# Altium project IN-5200_MAIN.PrjPcb
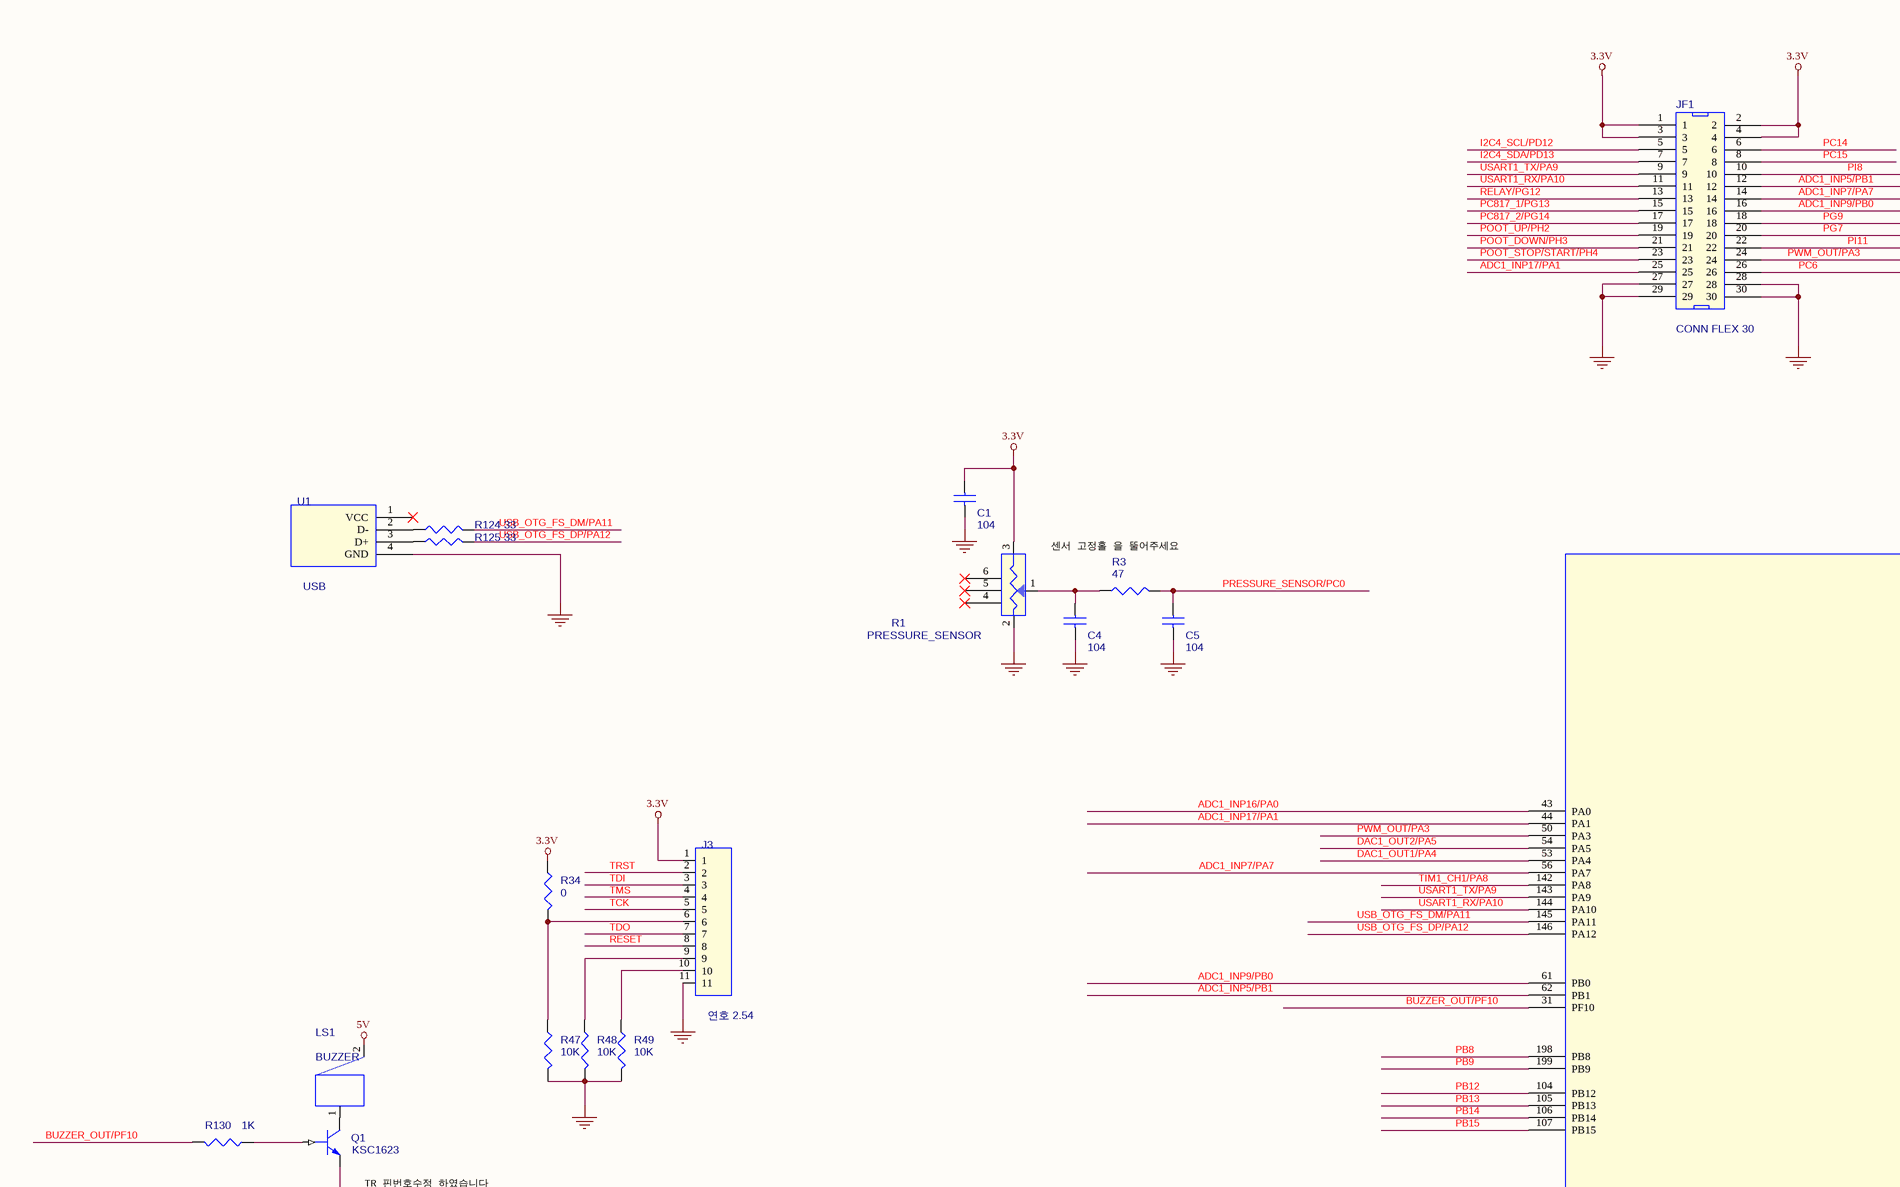
[diagram p0: PAGE1.SchDoc, top left]
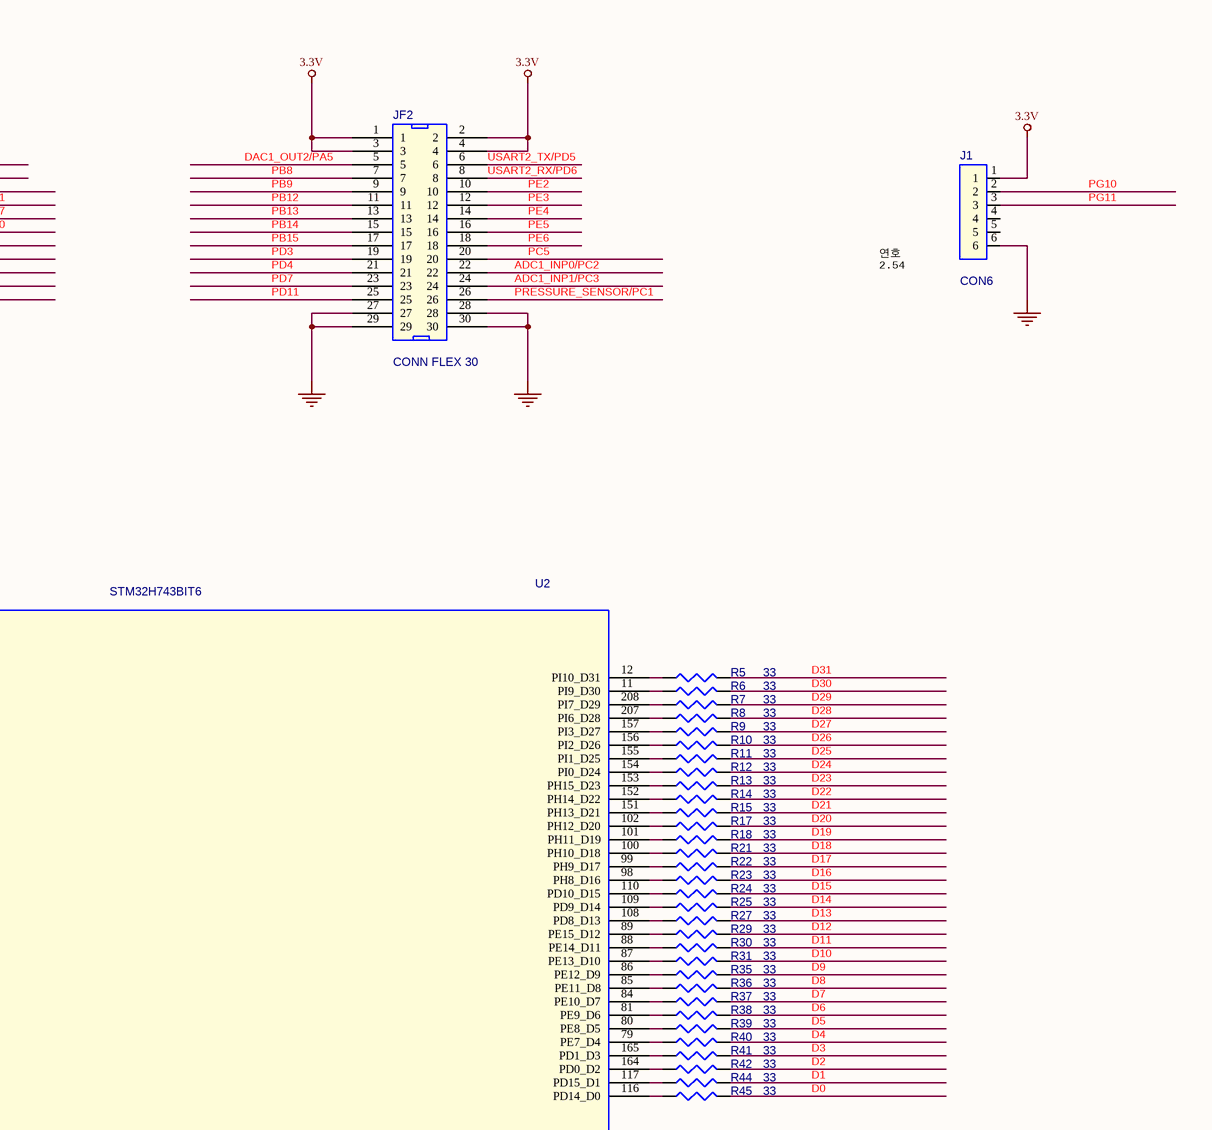
[diagram p1: PAGE1.SchDoc, top middle]
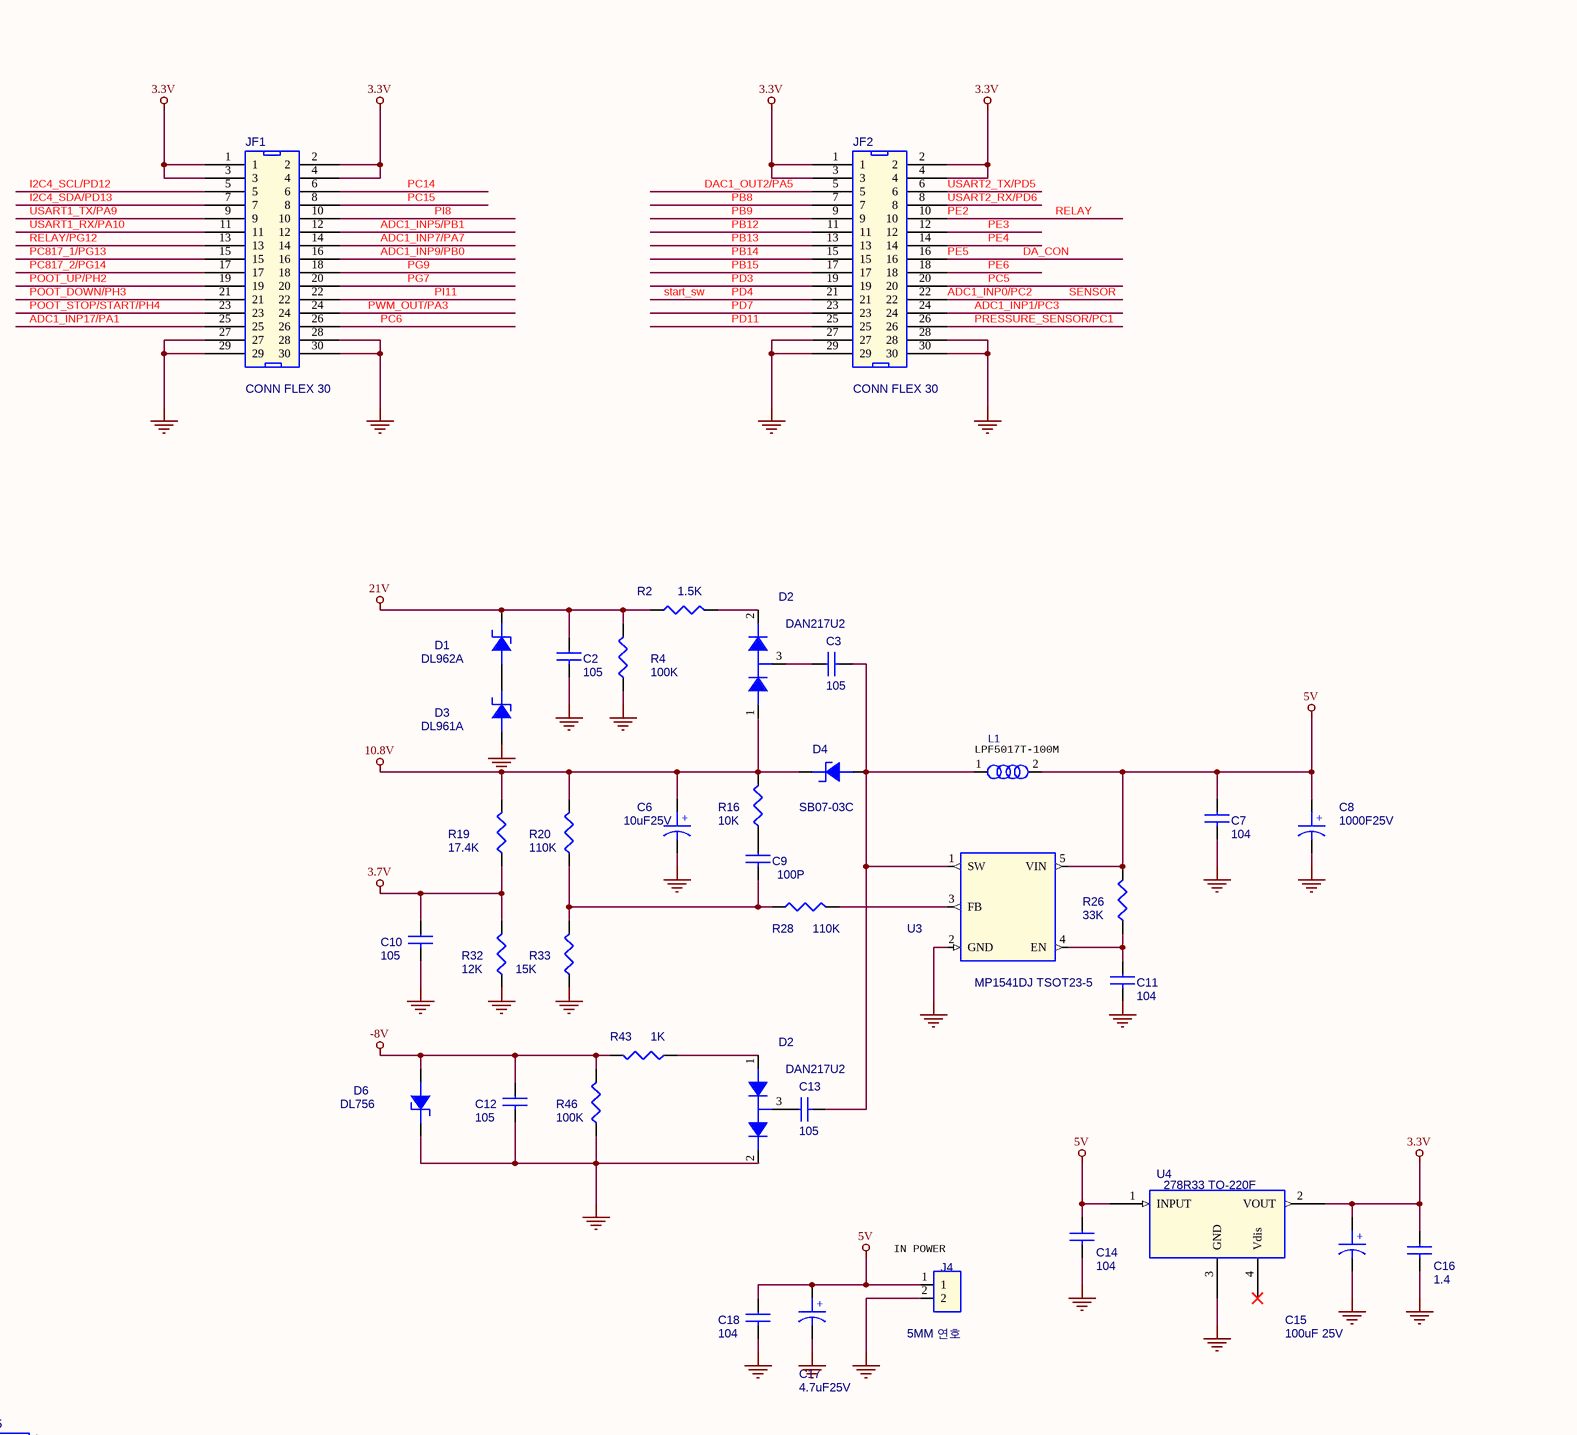
[diagram p2: PAGE1.SchDoc, top right]
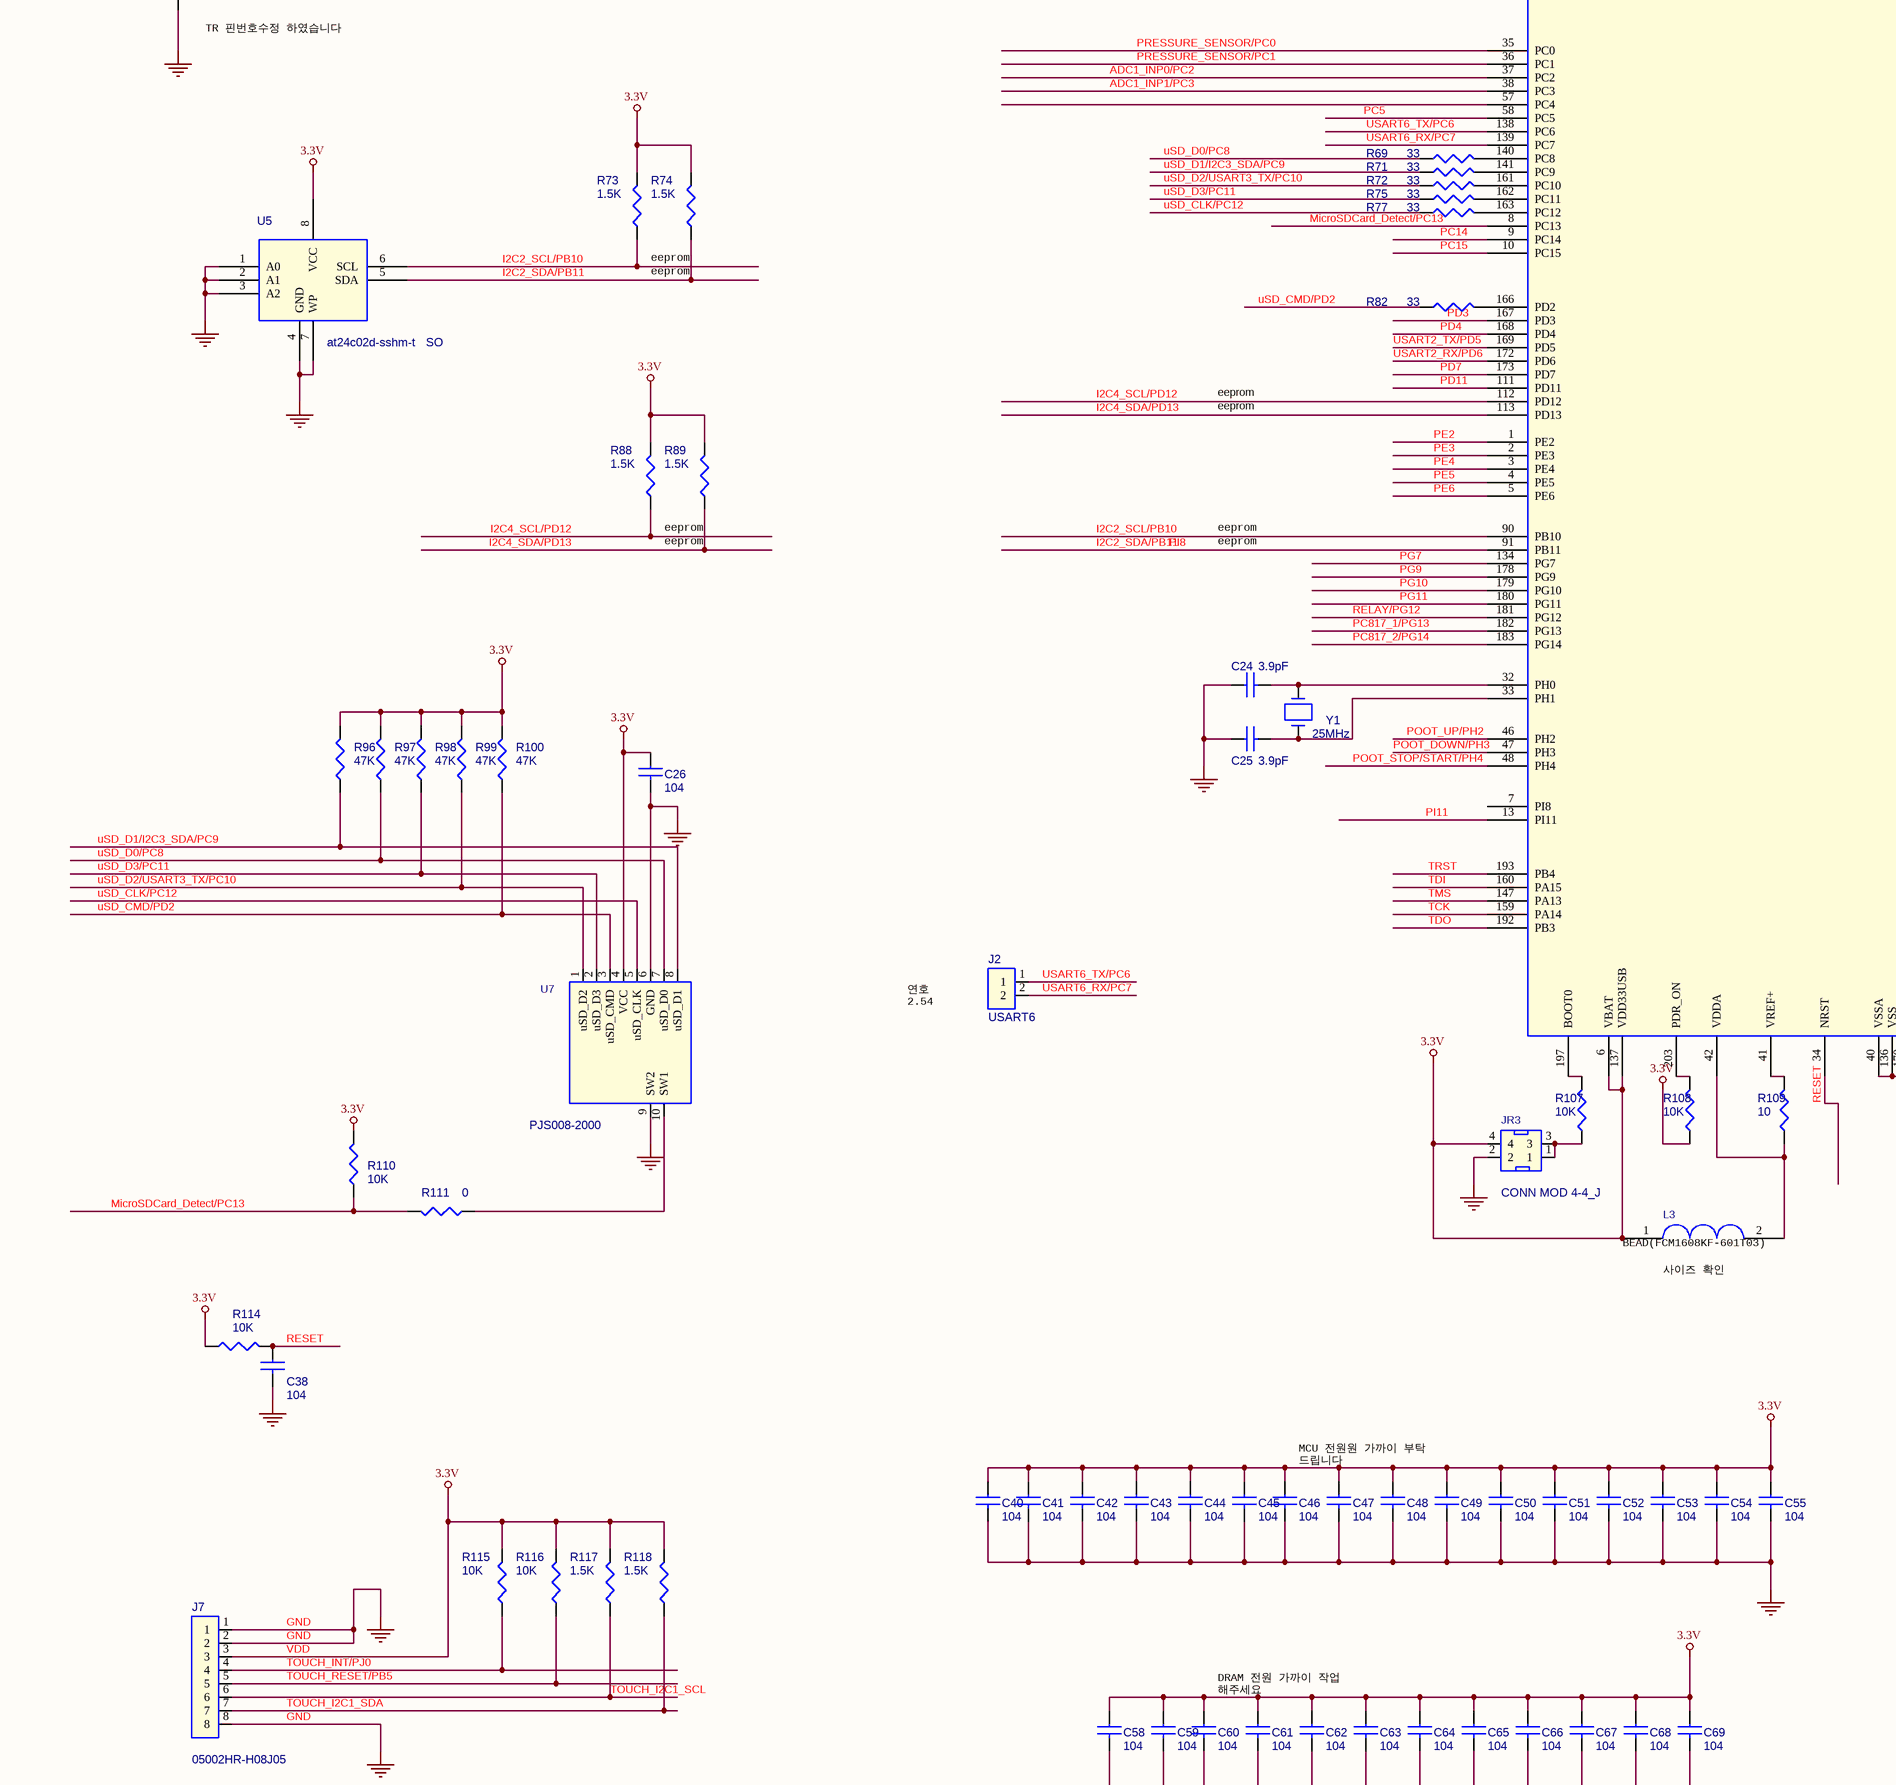
[diagram p3: PAGE1.SchDoc, centre left]
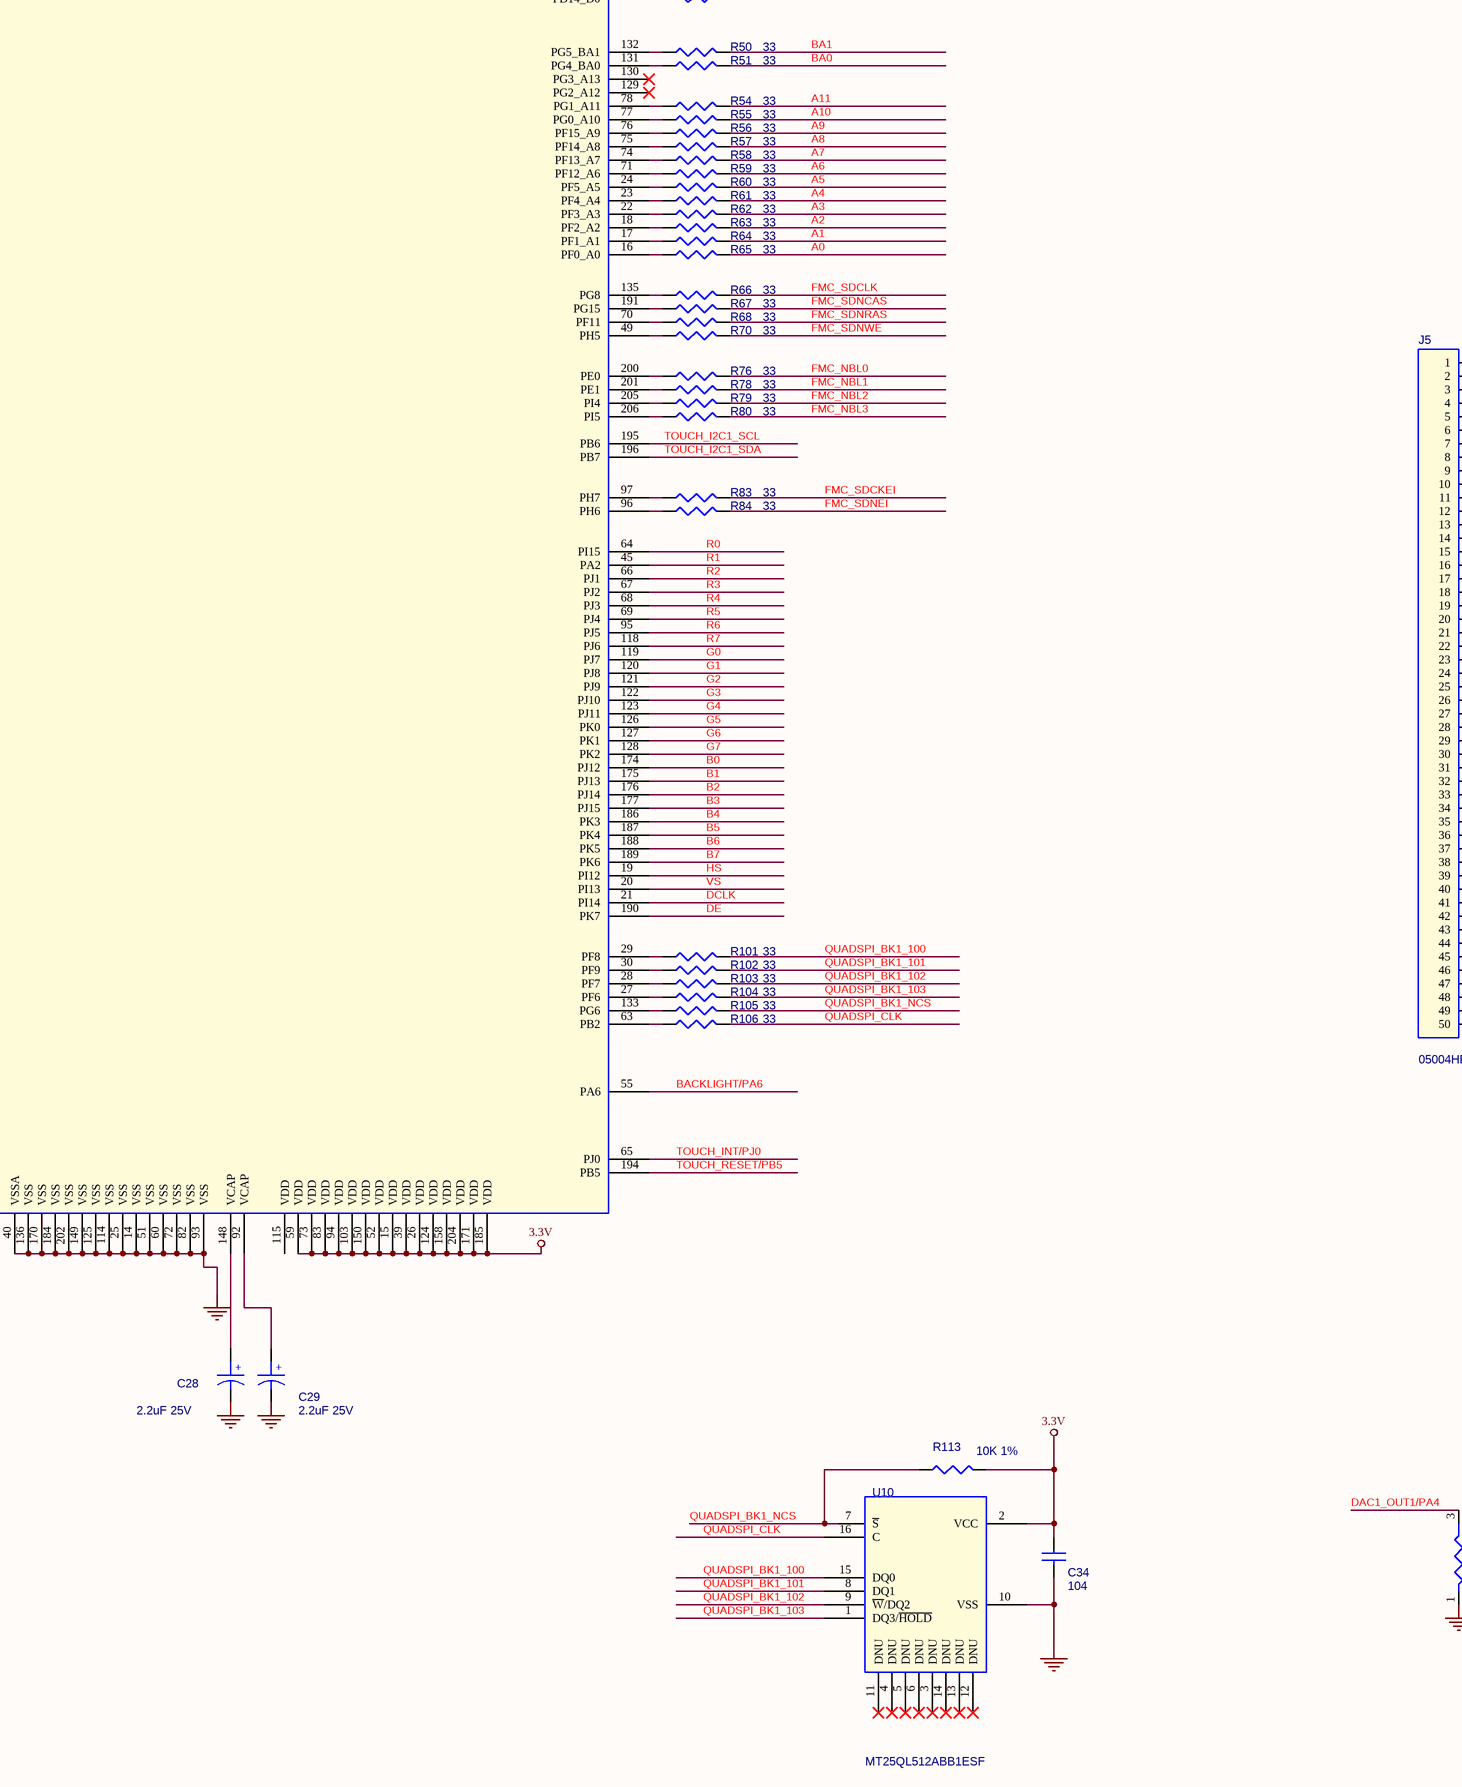
[diagram p4: PAGE1.SchDoc, centre middle]
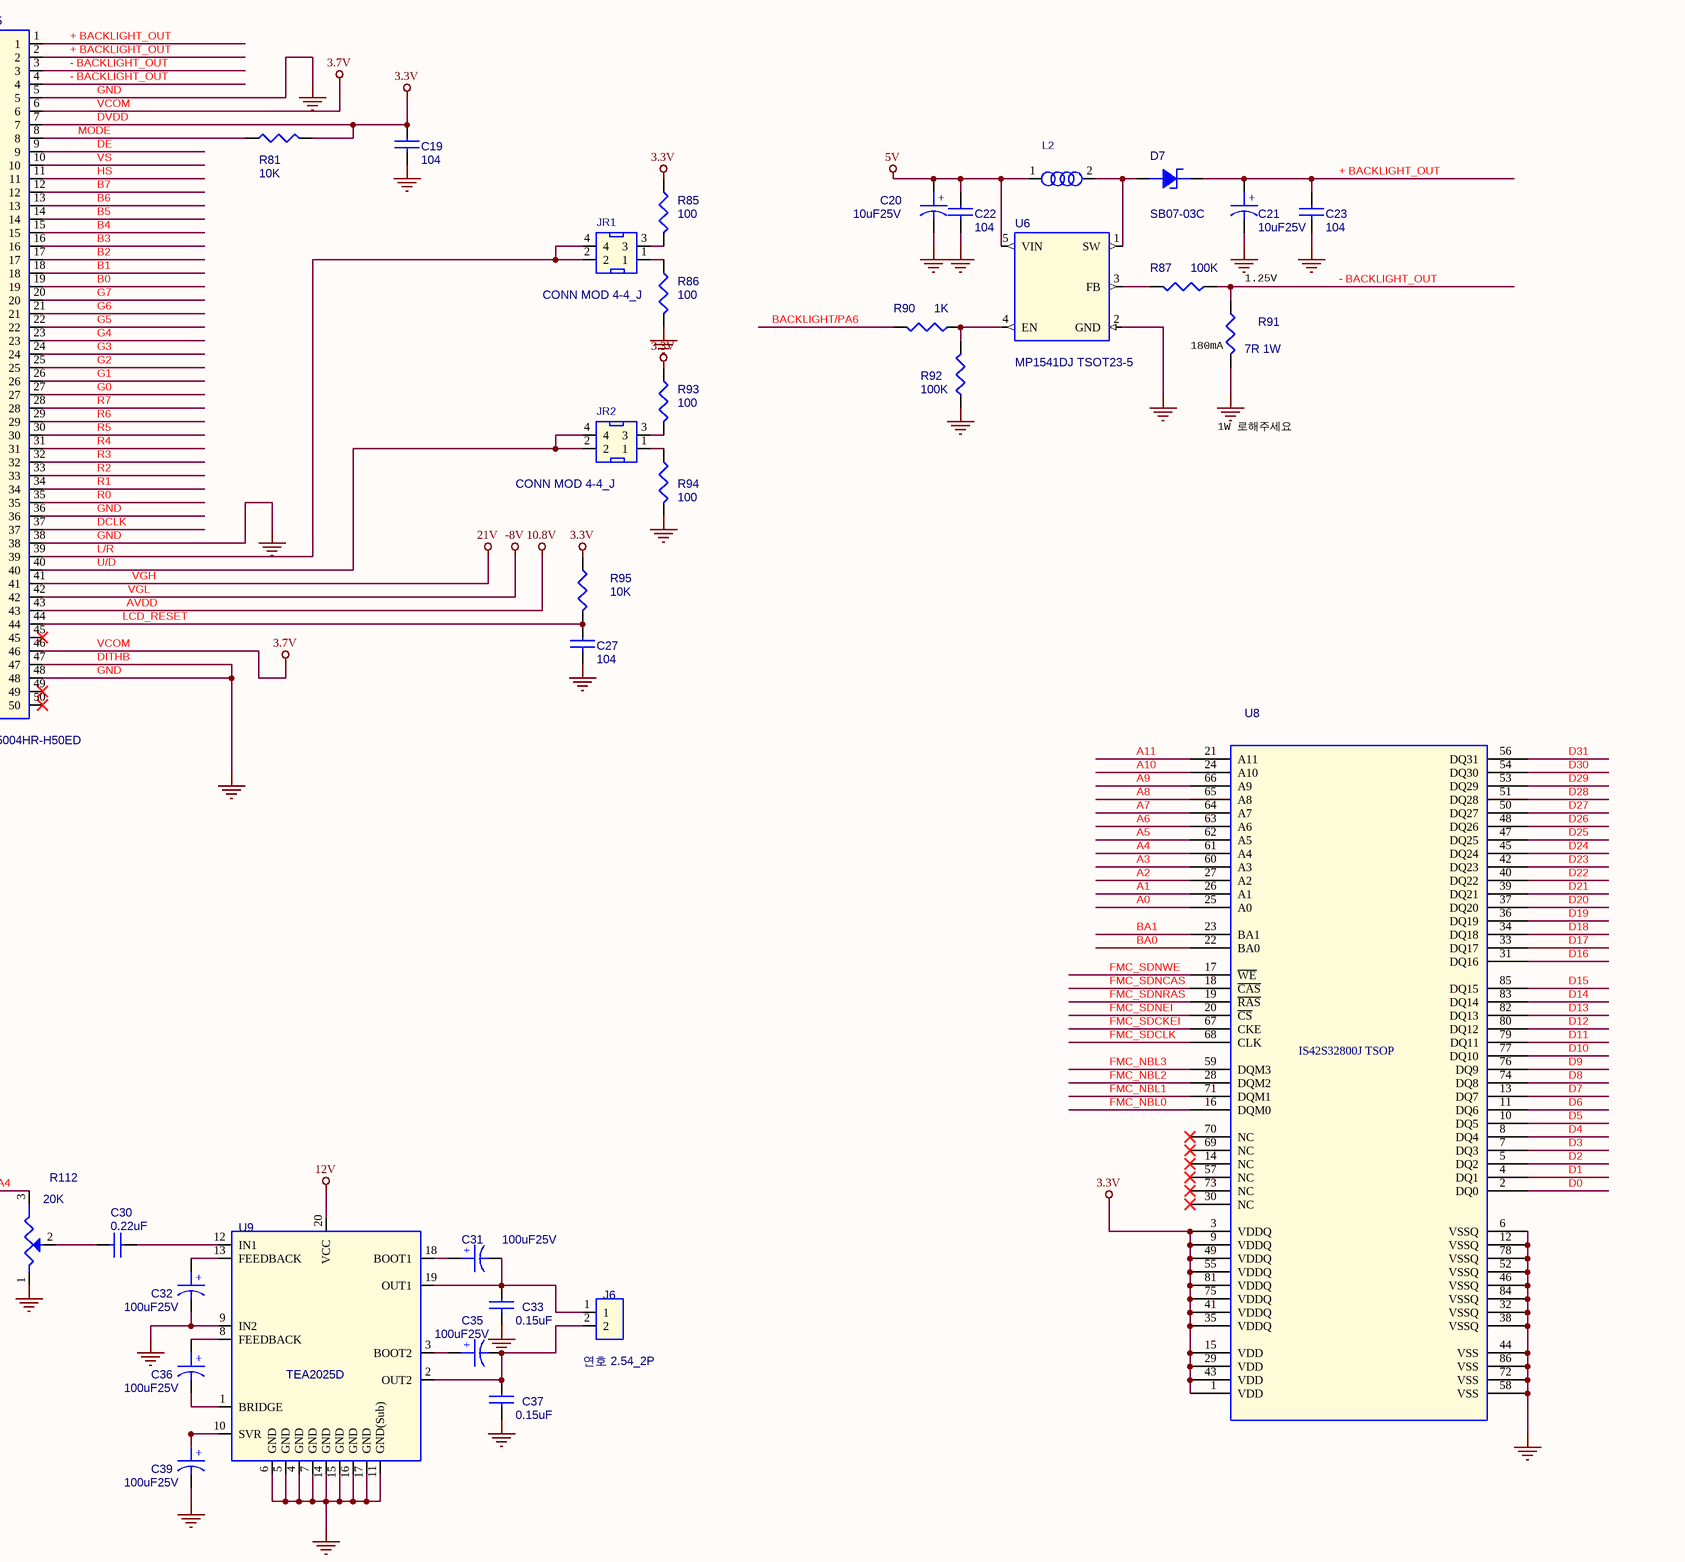
[diagram p5: PAGE1.SchDoc, centre right]
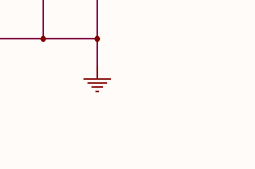
[diagram p6: PAGE1.SchDoc, bottom left]
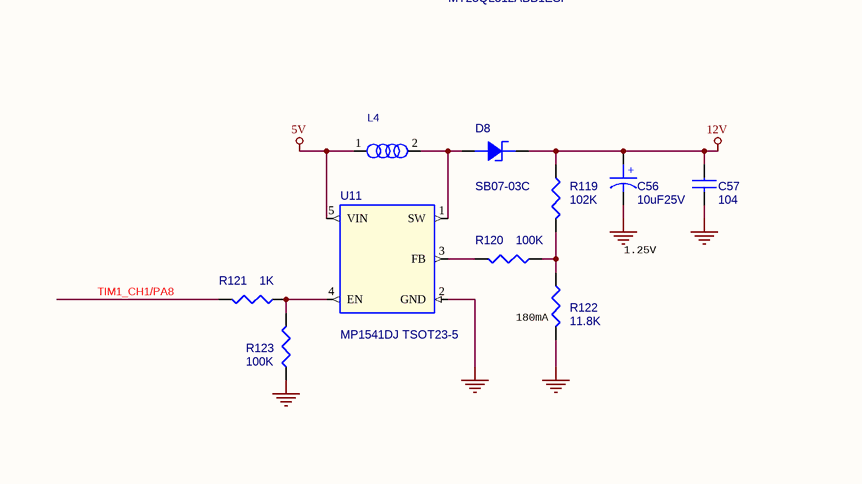
[diagram p7: PAGE1.SchDoc, bottom middle]
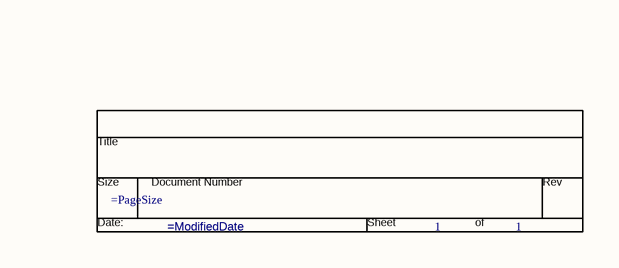
[diagram p8: PAGE1.SchDoc, bottom right]
1 sheet, 234 parts. Net scope: global (net labels, ports and power ports of the same name join across sheets).

## Sheet PAGE1.SchDoc
size 1071 x 817 mm; Page Create Date: March  8, 1995; Page Number: 1; Page Size: Custom; Comment: TitleBlock0; Page Count: 1; DsnPath: C:\Users\user\Desktop\IN-5200_MAIN.DSN; SchematicName: SCHEMATIC1; PageName: PAGE1; PageSize: Custom; TopSchematic: True

### Parts
(Parts that share a designator on the sheet are numbered #1, #2 ... from top to bottom, then left to right.)
*  Page Count: 1  (hidden comment: TitleBlock0)  (graphical)
C1  104  [C_2012]
C2  105  [C_2012]
C3  105  [C_2012]
C4  104  [C_2012]
C5  104  [C_2012]
C6  10uF25V  [ECD_5PAI]
C7  104  [C_2012]
C8  1000F25V  [ECD_10PAI]
C9  100P  [C_2012]
C10  105  [C_2012]
C11  104  [C_2012]
C12  105  [C_2012]
C13  105  [C_2012]
C14  104  [C_2012]
C15  100uF 25V  [ECD_5PAI]
C16  1.4  [C_2012]
C17  4.7uF25V  [ECD_5PAI]
C18  104  [C_2012]
C19  104  [C_2012]
C20  10uF25V  [ECD_5PAI]
C21  10uF25V  [ECD_5PAI]
C22  104  [C_2012]
C23  104  [C_2012]
C24  3.9pF  [C_2012]
C25  3.9pF  [C_2012]
C26  104  [C_2012]
C27  104  [C_2012]
C28  2.2uF 25V  [ECD_5PAI]
C29  2.2uF 25V  [ECD_5PAI]
C30  0.22uF  [C_2012]
C31  100uF25V  [ECD_5PAI]
C32  100uF25V  [ECD_5PAI]
C33  0.15uF  [C_2012]
C34  104  [C_2012]
C35  100uF25V  [ECD_5PAI]
C36  100uF25V  [ECD_5PAI]
C37  0.15uF  [C_2012]
C38  104  [C_2012]
C39  100uF25V  [ECD_5PAI]
C40  104  [C_2012]
C41  104  [C_2012]
C42  104  [C_2012]
C43  104  [C_2012]
C44  104  [C_2012]
C45  104  [C_2012]
C46  104  [C_2012]
C47  104  [C_2012]
C48  104  [C_2012]
C49  104  [C_2012]
C50  104  [C_2012]
C51  104  [C_2012]
C52  104  [C_2012]
C53  104  [C_2012]
C54  104  [C_2012]
C55  104  [C_2012]
C56  10uF25V  [ECD_5PAI]
C57  104  [C_2012]
C58  104  [C_2012]
C59  104  [C_2012]
C60  104  [C_2012]
C61  104  [C_2012]
C62  104  [C_2012]
C63  104  [C_2012]
C64  104  [C_2012]
C65  104  [C_2012]
C66  104  [C_2012]
C67  104  [C_2012]
C68  104  [C_2012]
C69  104  [C_2012]
D1  DL962A  [DIODE_DIP]
D2#1  DAN217U2  [SOT23]
D2#2  DAN217U2  [SOT23]
D3  DL961A  [DIODE_DIP]
D4  SB07-03C  [SB07-03C_SOT23]
D6  DL756  [DIODE_DIP]
D7  SB07-03C  [SB07-03C_SOT23]
D8  SB07-03C  [SB07-03C_SOT23]
J1  CON6  [SMW250-06]
J2  USART6  [SMW250-02]
J3  연호 2.54  [SMW250-11]
J4  5MM 연호  [YW500-02]
J5  05004HR-H50ED  [05004HR-H50ED-1]
J6  연호 2.54_2P  [SMW250-02]
J7  05002HR-H08J05  [05002HR-H08J05]
JF1#1  CONN FLEX 30  [CONN_2.54]
JF1#2  CONN FLEX 30  [CONN_2.54]
JF2#1  CONN FLEX 30  [CONN_2.54]
JF2#2  CONN FLEX 30  [CONN_2.54]
JR1  CONN MOD 4-4_J  [CONN_MOD44]
JR2  CONN MOD 4-4_J  [CONN_MOD44]
JR3  CONN MOD 4-4_J  [CONN_MOD44]
L1  101  [LPF5017T-100M]  (value not drawn)
L2  101  [LPF5017T-100M]  (value not drawn)
L3  TRANSFORMER AUTO  [L_2012]  (value not drawn)
L4  101  [LPF5017T-100M]  (value not drawn)
LS1  BUZZER
Q1  KSC1623
R1  PRESSURE_SENSOR  [PRESSURE_SENSOR]
R2  1.5K  [R_2012]
R3  47  [R_2012]
R4  100K  [R_2012]
R5  33  [R_2012]
R6  33  [R_2012]
R7  33  [R_2012]
R8  33  [R_2012]
R9  33  [R_2012]
R10  33  [R_2012]
R11  33  [R_2012]
R12  33  [R_2012]
R13  33  [R_2012]
R14  33  [R_2012]
R15  33  [R_2012]
R16  10K  [R_2012]
R17  33  [R_2012]
R18  33  [R_2012]
R19  17.4K  [R_2012]
R20  110K  [R_2012]
R21  33  [R_2012]
R22  33  [R_2012]
R23  33  [R_2012]
R24  33  [R_2012]
R25  33  [R_2012]
R26  33K  [R_2012]
R27  33  [R_2012]
R28  110K  [R_2012]
R29  33  [R_2012]
R30  33  [R_2012]
R31  33  [R_2012]
R32  12K  [R_2012]
R33  15K  [R_2012]
R34  0  [R_2012]
R35  33  [R_2012]
R36  33  [R_2012]
R37  33  [R_2012]
R38  33  [R_2012]
R39  33  [R_2012]
R40  33  [R_2012]
R41  33  [R_2012]
R42  33  [R_2012]
R43  1K  [R_2012]
R44  33  [R_2012]
R45  33  [R_2012]
R46  100K  [R_2012]
R47  10K  [R_2012]
R48  10K  [R_2012]
R49  10K  [R_2012]
R50  33  [R_2012]
R51  33  [R_2012]
R54  33  [R_2012]
R55  33  [R_2012]
R56  33  [R_2012]
R57  33  [R_2012]
R58  33  [R_2012]
R59  33  [R_2012]
R60  33  [R_2012]
R61  33  [R_2012]
R62  33  [R_2012]
R63  33  [R_2012]
R64  33  [R_2012]
R65  33  [R_2012]
R66  33  [R_2012]
R67  33  [R_2012]
R68  33  [R_2012]
R69  33  [R_2012]
R70  33  [R_2012]
R71  33  [R_2012]
R72  33  [R_2012]
R73  1.5K  [R_2012]
R74  1.5K  [R_2012]
R75  33  [R_2012]
R76  33  [R_2012]
R77  33  [R_2012]
R78  33  [R_2012]
R79  33  [R_2012]
R80  33  [R_2012]
R81  10K  [R_2012]
R82  33  [R_2012]
R83  33  [R_2012]
R84  33  [R_2012]
R85  100  [R_2012]
R86  100  [R_2012]
R87  100K  [R_2012]
R88  1.5K  [R_2012]
R89  1.5K  [R_2012]
R90  1K  [R_2012]
R91  7R 1W  [R_2012]
R92  100K  [R_2012]
R93  100  [R_2012]
R94  100  [R_2012]
R95  10K  [R_2012]
R96  47K  [R_2012]
R97  47K  [R_2012]
R98  47K  [R_2012]
R99  47K  [R_2012]
R100  47K  [R_2012]
R101  33  [R_2012]
R102  33  [R_2012]
R103  33  [R_2012]
R104  33  [R_2012]
R105  33  [R_2012]
R106  33  [R_2012]
R107  10K  [R_2012]
R108  10K  [R_2012]
R109  10  [R_2012]
R110  10K  [R_2012]
R111  0  [R_2012]
R112  20K  [R_2012]
R113  10K 1%  [R_2012]
R114  10K  [VRES\WIW1036(3323)P]
R115  10K  [R_2012]
R116  10K  [R_2012]
R117  1.5K  [R_2012]
R118  1.5K  [R_2012]
R119  102K  [R_2012]
R120  100K  [R_2012]
R121  1K  [R_2012]
R122  11.8K  [R_2012]
R123  100K  [R_2012]
R124  33  [R_2012]
R125  33  [R_2012]
R130  1K
U1  USB  [CON4_12505WR\]
U2  STM32H743BIT6  [STM32H743BIT6_0.5_208]
U3  MP1541DJ TSOT23-5  [SOT23-5]
U4  278R33 TO-220F
U5  at24c02d-sshm-t   SO  [SO8_P1.27_L6]
U6  MP1541DJ TSOT23-5  [SOT23-5]
U7  PJS008-2000  [7MSDP-1]
U8  IS42S32800J TSOP  [IS42S32800J_0.5_86]
U9  TEA2025D  [SO20_P1.27_L10.3]
U10  MT25QL512ABB1ESF  [MT25QL512ABB1ESF_SO16]
U11  MP1541DJ TSOT23-5  [SOT23-5]
Y1  25MHz  [XTAL_SMD]

### Nets
5V: C7.1 C8.1 C14.1 C17.1 C18.1 C20.1 C22.1 J4.1 L1.2(SF) L2.1(SF) L4.1(SF) LS1.2(B) R26.2 U3.5(VIN) U4.1(INPUT) U6.5(VIN) U11.5(VIN)
12V: C56.1 C57.1 D8.2(CATHODE) R119.1 U9.20(VCC)
AVDD: C6.1 D2#1.1(CATHODE) D4.2(CATHODE) J5.43 R16.2 R19.2 R20.2  [also labelled 10.8V]
DITHB: C2.2 C7.2 C10.2 C11.2 C12.2 C18.2 C24.1 C25.1 C34.2 D2#2.2(ANODE) D3.1(ANODE) D6.2(CATHODE) J1.6 J4.2 J5.5 J5.36 J5.38 J5.47 J5.48 J7.1 J7.2 J7.8 JF1#1.27 JF1#1.28 JF1#1.29 JF1#1.30 JF1#2.27 JF1#2.28 JF1#2.29 JF1#2.30 JF2#1.27 JF2#1.28 JF2#1.29 JF2#1.30 JF2#2.27 JF2#2.28 JF2#2.29 JF2#2.30 R1.2(WIPER) R4.1 R32.1 R33.1 R46.1 R86.2 R91.2 R92.1 R94.2 R112.1(A) R122.2 R123.1 U1.4(GND) U2.14(VSS) U2.25(VSS) U2.40(VSSA) U2.51(VSS) U2.60(VSS) U2.72(VSS) U2.82(VSS) U2.93(VSS) U2.114(VSS) U2.125(VSS) U2.136(VSS) U2.149(VSS) U2.170(VSS) U2.184(VSS) U2.202(VSS) U3.2(GND) U8.6(VSSQ) U8.12(VSSQ) U8.32(VSSQ) U8.38(VSSQ) U8.44(VSS) U8.46(VSSQ) U8.52(VSSQ) U8.58(VSS) U8.72(VSS) U8.78(VSSQ) U8.84(VSSQ) U8.86(VSS) U10.10(VSS) U11.2(GND)  [also labelled GND]
DVDD: C1.1 C15.1 C16.1 C19.1 C26.1 C34.1 C40.1 C41.1 C42.1 C43.1 C44.1 C45.1 C46.1 C47.1 C48.1 C49.1 C50.1 C51.1 C52.1 C53.1 C54.1 C55.1 C58.1 C59.1 C60.1 C61.1 C62.1 C63.1 C64.1 C65.1 C66.1 C67.1 C68.1 C69.1 J1.1 J3.1 J5.7 J7.3 JF1#1.1 JF1#1.2 JF1#1.3 JF1#1.4 JF1#2.1 JF1#2.2 JF1#2.3 JF1#2.4 JF2#1.1 JF2#1.2 JF2#1.3 JF2#1.4 JF2#2.1 JF2#2.2 JF2#2.3 JF2#2.4 JR3.4 L3.1(SF) R1.3(B) R34.1 R73.2 R74.2 R81.2 R85.1 R88.2 R89.2 R93.1 R95.1 R96.2 R97.2 R98.2 R99.2 R100.2 R108.1 R110.2 R113.2 R114.1 R115.2 R116.2 R117.2 R118.2 U2.6(VBAT) U2.15(VDD) U2.26(VDD) U2.39(VDD) U2.52(VDD) U2.59(VDD) U2.73(VDD) U2.83(VDD) U2.94(VDD) U2.103(VDD) U2.124(VDD) U2.137(VDD33USB) U2.150(VDD) U2.158(VDD) U2.171(VDD) U2.185(VDD) U2.204(VDD) U4.2(VOUT) U5.8(VCC) U7.4(VCC) U8.1(VDD) U8.3(VDDQ) U8.9(VDDQ) U8.15(VDD) U8.29(VDD) U8.35(VDDQ) U8.41(VDDQ) U8.43(VDD) U8.49(VDDQ) U8.55(VDDQ) U8.75(VDDQ) U8.81(VDDQ) U10.2(VCC)  [also labelled 3.3V, VDD]
GND POWER: J3.11 Q1.2(EMITTER) R47.2 R48.2 R49.2 U5.1(A0) U5.2(A1) U5.3(A2) U5.4(GND) U5.7(WP)
GND_POWER: C1.2 C4.2 C5.2 C6.2 C8.2 C14.2 C15.2 C16.2 C17.2 C19.2 C20.2 C21.2 C22.2 C23.2 C26.2 C27.2 C28.2 C29.2 C32.2 C33.2 C37.2 C38.2 C39.2 C40.2 C41.2 C42.2 C43.2 C44.2 C45.2 C46.2 C47.2 C48.2 C49.2 C50.2 C51.2 C52.2 C53.2 C54.2 C55.2 C56.2 C57.2 C58.2 C59.2 C60.2 C61.2 C62.2 C63.2 C64.2 C65.2 C66.2 C67.2 C68.2 C69.2 JR3.2 U4.3(GND) U6.2(GND) U7.6(GND) U7.9(SW2) U9.4(GND) U9.5(GND) U9.6(GND) U9.7(GND) U9.9(IN2) U9.11(GND(Sub)) U9.14(GND) U9.15(GND) U9.16(GND) U9.17(GND)
VCOM: C10.1 J5.6 J5.46 R19.1 R32.2  [also labelled 3.7V]
VGH: C2.1 D1.2(CATHODE) J5.41 R2.1 R4.2  [also labelled 21V]
VGL: C12.1 D6.1(ANODE) J5.42 R43.2 R46.2  [also labelled -8V]
+ BACKLIGHT_OUT: C21.1 C23.1 D7.2(CATHODE) J5.1 J5.2
- BACKLIGHT_OUT: J5.3 J5.4 R87.1 R91.1
A0: R65.2 U8.25(A0)
A1: R64.2 U8.26(A1)
A2: R63.2 U8.27(A2)
A3: R62.2 U8.60(A3)
A4: R61.2 U8.61(A4)
A5: R60.2 U8.62(A5)
A6: R59.2 U8.63(A6)
A7: R58.2 U8.64(A7)
A8: R57.2 U8.65(A8)
A9: R56.2 U8.66(A9)
A10: R55.2 U8.24(A10)
A11: R54.2 U8.21(A11)
ADC1_INP0/PC2: JF2#1.22 JF2#2.22 U2.37(PC2)  [also labelled SENSOR]
ADC1_INP1/PC3: JF2#1.24 JF2#2.24 U2.38(PC3)
ADC1_INP5/PB1: JF1#1.12 JF1#2.12 U2.62(PB1)
ADC1_INP7/PA7: JF1#1.14 JF1#2.14 U2.56(PA7)
ADC1_INP9/PB0: JF1#1.16 JF1#2.16 U2.61(PB0)
ADC1_INP16/PA0: U2.43(PA0)
ADC1_INP17/PA1: JF1#1.25 JF1#2.25 U2.44(PA1)
B0: J5.19 U2.174(PJ12)
B1: J5.18 U2.175(PJ13)
B2: J5.17 U2.176(PJ14)
B3: J5.16 U2.177(PJ15)
B4: J5.15 U2.186(PK3)
B5: J5.14 U2.187(PK4)
B6: J5.13 U2.188(PK5)
B7: J5.12 U2.189(PK6)
BA0: R51.2 U8.22(BA0)
BA1: R50.2 U8.23(BA1)
BACKLIGHT/PA6: R90.2 U2.55(PA6)
BUZZER_OUT/PF10: R130.2 U2.31(PF10)
D0: R45.2 U8.2(DQ0)
D1: R44.2 U8.4(DQ1)
D2: R42.2 U8.5(DQ2)
D3: R41.2 U8.7(DQ3)
D4: R40.2 U8.8(DQ4)
D5: R39.2 U8.10(DQ5)
D6: R38.2 U8.11(DQ6)
D7: R37.2 U8.13(DQ7)
D8: R36.2 U8.74(DQ8)
D9: R35.2 U8.76(DQ9)
D10: R31.2 U8.77(DQ10)
D11: R30.2 U8.79(DQ11)
D12: R29.2 U8.80(DQ12)
D13: R27.2 U8.82(DQ13)
D14: R25.2 U8.83(DQ14)
D15: R24.2 U8.85(DQ15)
D16: R23.2 U8.31(DQ16)
D17: R22.2 U8.33(DQ17)
D18: R21.2 U8.34(DQ18)
D19: R18.2 U8.36(DQ19)
D20: R17.2 U8.37(DQ20)
D21: R15.2 U8.39(DQ21)
D22: R14.2 U8.40(DQ22)
D23: R13.2 U8.42(DQ23)
D24: R12.2 U8.45(DQ24)
D25: R11.2 U8.47(DQ25)
D26: R10.2 U8.48(DQ26)
D27: R9.2 U8.50(DQ27)
D28: R8.2 U8.51(DQ28)
D29: R7.2 U8.53(DQ29)
D30: R6.2 U8.54(DQ30)
D31: R5.2 U8.56(DQ31)
DA_CON: JF2#1.16 JF2#2.16 U2.4(PE5)  [also labelled PE5]
DAC1_OUT1/PA4: R112.3(B) U2.53(PA4)
DAC1_OUT2/PA5: JF2#1.5 JF2#2.5 U2.54(PA5)
DCLK: J5.37 U2.21(PI14)
DE: J5.9 U2.190(PK7)
FMC_NBL0: R76.2 U8.16(DQM0)
FMC_NBL1: R78.2 U8.71(DQM1)
FMC_NBL2: R79.2 U8.28(DQM2)
FMC_NBL3: R80.2 U8.59(DQM3)
FMC_SDCKEI: R83.2 U8.67(CKE)
FMC_SDCLK: R66.2 U8.68(CLK)
FMC_SDNCAS: R67.2 U8.18(~{CAS})
FMC_SDNEI: R84.2 U8.20(~{CS})
FMC_SDNRAS: R68.2 U8.19(~{RAS})
FMC_SDNWE: R70.2 U8.17(~{WE})
G0: J5.27 U2.119(PJ7)
G1: J5.26 U2.120(PJ8)
G2: J5.25 U2.121(PJ9)
G3: J5.24 U2.122(PJ10)
G4: J5.23 U2.123(PJ11)
G5: J5.22 U2.126(PK0)
G6: J5.21 U2.127(PK1)
G7: J5.20 U2.128(PK2)
HS: J5.11 U2.19(PI12)
I2C2_SCL/PB10: R73.1 U2.90(PB10) U5.6(SCL)
I2C2_SDA/PB11: JF1#1.10 JF1#2.10 R74.1 U2.91(PB11) U5.5(SDA)  [also labelled PI8]
I2C4_SCL/PD12: JF1#1.5 JF1#2.5 R88.1 U2.112(PD12)
I2C4_SDA/PD13: JF1#1.7 JF1#2.7 R89.1 U2.113(PD13)
L/R: J5.39 JR1.2 JR1.4
LCD_RESET: C27.1 J5.44 R95.2
MicroSDCard_Detect/PC13: R110.1 R111.2 U2.8(PC13)
MODE: J5.8 R81.1
PB8: JF2#1.7 JF2#2.7 U2.198(PB8)
PB9: JF2#1.9 JF2#2.9 U2.199(PB9)
PB12: JF2#1.11 JF2#2.11 U2.104(PB12)
PB13: JF2#1.13 JF2#2.13 U2.105(PB13)
PB14: JF2#1.15 JF2#2.15 U2.106(PB14)
PB15: JF2#1.17 JF2#2.17 U2.107(PB15)
PC5: JF2#1.20 JF2#2.20 U2.58(PC5)
PC6: JF1#1.26 JF1#2.26
PC14: JF1#1.6 JF1#2.6 U2.9(PC14)
PC15: JF1#1.8 JF1#2.8 U2.10(PC15)
PC817_1/PG13: JF1#1.15 JF1#2.15 U2.182(PG13)
PC817_2/PG14: JF1#1.17 JF1#2.17 U2.183(PG14)
PD3: JF2#1.19 JF2#2.19 U2.167(PD3)
PD4: JF2#1.21 JF2#2.21 U2.168(PD4)  [also labelled start_sw]
PD7: JF2#1.23 JF2#2.23 U2.173(PD7)
PD11: JF2#1.25 JF2#2.25 U2.111(PD11)
PE2: JF2#1.10 JF2#2.10 U2.1(PE2)  [also labelled RELAY]
PE3: JF2#1.12 JF2#2.12 U2.2(PE3)
PE4: JF2#1.14 JF2#2.14 U2.3(PE4)
PE6: JF2#1.18 JF2#2.18 U2.5(PE6)
PG7: JF1#1.20 JF1#2.20 U2.134(PG7)
PG9: JF1#1.18 JF1#2.18 U2.178(PG9)
PG10: J1.2 U2.179(PG10)
PG11: J1.3 U2.180(PG11)
PI11: JF1#1.22 JF1#2.22 U2.13(PI11)
POOT_DOWN/PH3: JF1#1.21 JF1#2.21 U2.47(PH3)
POOT_STOP/START/PH4: JF1#1.23 JF1#2.23 U2.48(PH4)
POOT_UP/PH2: JF1#1.19 JF1#2.19 U2.46(PH2)
PRESSURE_SENSOR/PC0: C5.1 R3.2 U2.35(PC0)
PRESSURE_SENSOR/PC1: JF2#1.26 JF2#2.26 U2.36(PC1)
PWM_OUT/PA3: JF1#1.24 JF1#2.24 U2.50(PA3)
QUADSPI_BK1_100: R101.2 U10.15(DQ0)
QUADSPI_BK1_101: R102.2 U10.8(DQ1)
QUADSPI_BK1_102: R103.2 U10.9(~{W}/DQ2)
QUADSPI_BK1_103: R104.2 U10.1(DQ3/~{HOLD})
QUADSPI_BK1_NCS: R105.2 R113.1 U10.7(~{S})
QUADSPI_CLK: R106.2 U10.16(C)
R0: J5.35 U2.64(PI15)
R1: J5.34 U2.45(PA2)
R2: J5.33 U2.66(PJ1)
R3: J5.32 U2.67(PJ2)
R4: J5.31 U2.68(PJ3)
R5: J5.30 U2.69(PJ4)
R6: J5.29 U2.95(PJ5)
R7: J5.28 U2.118(PJ6)
RELAY/PG12: JF1#1.13 JF1#2.13 U2.181(PG12)
RESET: C38.1 J3.8 R114.2 U2.34(NRST)
TCK: J3.5 U2.159(PA14)
TDI: J3.3 U2.160(PA15)
TDO: J3.7 U2.192(PB3)
TIM1_CH1/PA8: R121.2 U2.142(PA8)
TMS: J3.4 U2.147(PA13)
TOUCH_I2C1_SCL: J7.6 R117.1 U2.195(PB6)
TOUCH_I2C1_SDA: J7.7 R118.1 U2.196(PB7)
TOUCH_INT/PJ0: J7.4 R115.1 U2.65(PJ0)
TOUCH_RESET/PB5: J7.5 R116.1 U2.194(PB5)
TRST: J3.2 U2.193(PB4)
U/D: J5.40 JR2.2 JR2.4
USART1_RX/PA10: JF1#1.11 JF1#2.11 U2.144(PA10)
USART1_TX/PA9: JF1#1.9 JF1#2.9 U2.143(PA9)
USART2_RX/PD6: JF2#1.8 JF2#2.8 U2.172(PD6)
USART2_TX/PD5: JF2#1.6 JF2#2.6 U2.169(PD5)
USART6_RX/PC7: J2.2 U2.139(PC7)
USART6_TX/PC6: J2.1 U2.138(PC6)
USB_OTG_FS_DM/PA11: R124.2 U2.145(PA11)
USB_OTG_FS_DP/PA12: R125.2 U2.146(PA12)
uSD_CLK/PC12: R77.1 U7.5(uSD_CLK)
uSD_CMD/PD2: R82.1 R100.1 U7.3(uSD_CMD)
uSD_D0/PC8: R69.1 R97.1 U7.7(uSD_D0)
uSD_D1/I2C3_SDA/PC9: R71.1 R96.1 U7.8(uSD_D1)
uSD_D2/USART3_TX/PC10: R72.1 R99.1 U7.1(uSD_D2)
uSD_D3/PC11: R75.1 R98.1 U7.2(uSD_D3)
VS: J5.10 U2.20(PI13)
NetC3_1: C3.1 D2#1.3(COM)
NetC3_2: C3.2 C13.2 D4.1(ANODE) L1.1(SF) U3.1(SW)
NetC4_1: C4.1 R1.1(A) R3.1
NetC9_1: C9.1 R16.1
NetC9_2: C9.2 R20.1 R28.1 R33.2
NetC11_1: C11.1 R26.1 U3.4(EN)
NetC13_1: C13.1 D2#2.3(COM)
NetC24_2: C24.2 U2.32(PH0) Y1.2
NetC25_2: C25.2 U2.33(PH1) Y1.1
NetC28_1: C28.1 U2.148(VCAP)
NetC29_1: C29.1 U2.92(VCAP)
NetC30_1: C30.1 U9.12(IN1)
NetC30_2: C30.2 R112.2(WIPER)
NetC31_1: C31.1 U9.18(BOOT1)
NetC31_2: C31.2 C33.1 J6.1 U9.19(OUT1)
NetC32_1: C32.1 U9.13(FEEDBACK)
NetC35_1: C35.1 U9.3(BOOT2)
NetC35_2: C35.2 C37.1 J6.2 U9.2(OUT2)
NetC36_1: C36.1 U9.8(FEEDBACK)
NetC36_2: C36.2 U9.1(BRIDGE)
NetC39_1: C39.1 U9.10(SVR)
NetD1_1: D1.1(ANODE) D3.2(CATHODE)
NetD2#1_2: D2#1.2(ANODE) R2.2
NetD2#2_1: D2#2.1(CATHODE) R43.1
NetD7_1: D7.1(ANODE) L2.2(SF) U6.1(SW)
NetD8_1: D8.1(ANODE) L4.2(SF) U11.1(SW)
NetJ3_6: J3.6 R34.2 R47.1
NetJ3_9: J3.9 R48.1
NetJ3_10: J3.10 R49.1
NetJR1_1: JR1.1 R86.1
NetJR1_3: JR1.3 R85.2
NetJR2_1: JR2.1 R94.1
NetJR2_3: JR2.3 R93.2
NetJR3_1: JR3.1 JR3.3 R107.1
NetL3_2: L3.2(SF) R109.1 U2.42(VDDA)
NetLS1_1: LS1.1(A) Q1.3(COLLECTOR)
NetQ1_1: Q1.1(BASE) R130.1
NetR5_1: R5.1 U2.12(PI10_D31)
NetR6_1: R6.1 U2.11(PI9_D30)
NetR7_1: R7.1 U2.208(PI7_D29)
NetR8_1: R8.1 U2.207(PI6_D28)
NetR9_1: R9.1 U2.157(PI3_D27)
NetR10_1: R10.1 U2.156(PI2_D26)
NetR11_1: R11.1 U2.155(PI1_D25)
NetR12_1: R12.1 U2.154(PI0_D24)
NetR13_1: R13.1 U2.153(PH15_D23)
NetR14_1: R14.1 U2.152(PH14_D22)
NetR15_1: R15.1 U2.151(PH13_D21)
NetR17_1: R17.1 U2.102(PH12_D20)
NetR18_1: R18.1 U2.101(PH11_D19)
NetR21_1: R21.1 U2.100(PH10_D18)
NetR22_1: R22.1 U2.99(PH9_D17)
NetR23_1: R23.1 U2.98(PH8_D16)
NetR24_1: R24.1 U2.110(PD10_D15)
NetR25_1: R25.1 U2.109(PD9_D14)
NetR27_1: R27.1 U2.108(PD8_D13)
NetR28_2: R28.2 U3.3(FB)
NetR29_1: R29.1 U2.89(PE15_D12)
NetR30_1: R30.1 U2.88(PE14_D11)
NetR31_1: R31.1 U2.87(PE13_D10)
NetR35_1: R35.1 U2.86(PE12_D9)
NetR36_1: R36.1 U2.85(PE11_D8)
NetR37_1: R37.1 U2.84(PE10_D7)
NetR38_1: R38.1 U2.81(PE9_D6)
NetR39_1: R39.1 U2.80(PE8_D5)
NetR40_1: R40.1 U2.79(PE7_D4)
NetR41_1: R41.1 U2.165(PD1_D3)
NetR42_1: R42.1 U2.164(PD0_D2)
NetR44_1: R44.1 U2.117(PD15_D1)
NetR45_1: R45.1 U2.116(PD14_D0)
NetR50_1: R50.1 U2.132(PG5_BA1)
NetR51_1: R51.1 U2.131(PG4_BA0)
NetR54_1: R54.1 U2.78(PG1_A11)
NetR55_1: R55.1 U2.77(PG0_A10)
NetR56_1: R56.1 U2.76(PF15_A9)
NetR57_1: R57.1 U2.75(PF14_A8)
NetR58_1: R58.1 U2.74(PF13_A7)
NetR59_1: R59.1 U2.71(PF12_A6)
NetR60_1: R60.1 U2.24(PF5_A5)
NetR61_1: R61.1 U2.23(PF4_A4)
NetR62_1: R62.1 U2.22(PF3_A3)
NetR63_1: R63.1 U2.18(PF2_A2)
NetR64_1: R64.1 U2.17(PF1_A1)
NetR65_1: R65.1 U2.16(PF0_A0)
NetR66_1: R66.1 U2.135(PG8)
NetR67_1: R67.1 U2.191(PG15)
NetR68_1: R68.1 U2.70(PF11)
NetR69_2: R69.2 U2.140(PC8)
NetR70_1: R70.1 U2.49(PH5)
NetR71_2: R71.2 U2.141(PC9)
NetR72_2: R72.2 U2.161(PC10)
NetR75_2: R75.2 U2.162(PC11)
NetR76_1: R76.1 U2.200(PE0)
NetR77_2: R77.2 U2.163(PC12)
NetR78_1: R78.1 U2.201(PE1)
NetR79_1: R79.1 U2.205(PI4)
NetR80_1: R80.1 U2.206(PI5)
NetR82_2: R82.2 U2.166(PD2)
NetR83_1: R83.1 U2.97(PH7)
NetR84_1: R84.1 U2.96(PH6)
NetR87_2: R87.2 U6.3(FB)
NetR90_1: R90.1 R92.2 U6.4(EN)
NetR101_1: R101.1 U2.29(PF8)
NetR102_1: R102.1 U2.30(PF9)
NetR103_1: R103.1 U2.28(PF7)
NetR104_1: R104.1 U2.27(PF6)
NetR105_1: R105.1 U2.133(PG6)
NetR106_1: R106.1 U2.63(PB2)
NetR107_2: R107.2 U2.197(BOOT0)
NetR108_2: R108.2 U2.203(PDR_ON)
NetR109_2: R109.2 U2.41(VREF+)
NetR111_1: R111.1 U7.10(SW1)
NetR119_2: R119.2 R120.1 R122.1
NetR120_2: R120.2 U11.3(FB)
NetR121_1: R121.1 R123.2 U11.4(EN)
NetR124_1: R124.1 U1.2(D-)
NetR125_1: R125.1 U1.3(D+)

Not connected (* = marked no-connect by the designer): J1 4 5; J5 45* 49* 50*; R1 4(B)* 5(B)* 6(B)*; U1 1(VCC)*; U2 7(PI8) 57(PC4) 115(VDD) 129(PG2_A12)* 130(PG3_A13)*; U4 4(Vdis)*; U8 14(NC)* 30(NC)* 57(NC)* 69(NC)* 70(NC)* 73(NC)*; U10 3(DNU)* 4(DNU)* 5(DNU)* 6(DNU)* 11(DNU)* 12(DNU)* 13(DNU)* 14(DNU)*

### Notes on the sheet
- 연호
  2.54
- 센서 고정홀 을 뚤어주세요
- (near L1) LPF5017T-100M
- (near Q1) TR 핀번호수정 하였습니다
- (near J4) IN POWER
- eeprom
- 1.25V
- (near R91) 180mA
- 1W 로해주세요
- (near L3) BEAD(FCM1608KF-601T03)
- (near L3) 사이즈 확인
- MCU 전원원 가까이 부탁
  드립니다
- DRAM 전원 가까이 작업
  해주세요
- (near R122) 180mA
- (in symbol CAPACITOR POL) +
- (in symbol CAPACITOR POL_0) +
- (in symbol TitleBlock0) Title; Size; Document Number; Rev; Date:; Sheet; of

### Library data of the parts
C1 = CAP NP_Dup1: Part Reference: C1; Value: 104; PCB Footprint: C_2012
C2 = CAP NP_Dup1: Part Reference: C2; Value: 105; PCB Footprint: C_2012
C3 = CAP NP_Dup1: Part Reference: C3; Value: 105; PCB Footprint: C_2012
C4 = CAP NP_Dup1: Part Reference: C4; Value: 104; PCB Footprint: C_2012
C5 = CAP NP_Dup1: Part Reference: C5; Value: 104; PCB Footprint: C_2012
C6 = CAPACITOR POL: Part Reference: C6; Value: 10uF25V; PCB Footprint: ECD_5PAI
C7 = CAP NP_Dup1: Part Reference: C7; Value: 104; PCB Footprint: C_2012
C8 = CAPACITOR POL: Part Reference: C8; Value: 1000F25V; PCB Footprint: ECD_10PAI
C9 = CAP NP_Dup1: Part Reference: C9; Value: 100P; PCB Footprint: C_2012
C10 = CAP NP_Dup1: Part Reference: C10; Value: 105; PCB Footprint: C_2012
C11 = CAP NP_Dup1: Part Reference: C11; Value: 104; PCB Footprint: C_2012
C12 = CAP NP_Dup1: Part Reference: C12; Value: 105; PCB Footprint: C_2012
C13 = CAP NP_Dup1: Part Reference: C13; Value: 105; PCB Footprint: C_2012
C14 = CAP NP_Dup1: Part Reference: C14; Value: 104; PCB Footprint: C_2012
C15 = CAPACITOR POL: Part Reference: C15; Value: 100uF 25V; PCB Footprint: ECD_5PAI
C16 = CAP NP_Dup1: Part Reference: C16; Value: 1.4; PCB Footprint: C_2012
C17 = CAPACITOR POL: Part Reference: C17; Value: 4.7uF25V; PCB Footprint: ECD_5PAI
C18 = CAP NP_Dup1: Part Reference: C18; Value: 104; PCB Footprint: C_2012
C19 = CAP NP_Dup1: Part Reference: C19; Value: 104; PCB Footprint: C_2012
C20 = CAPACITOR POL_0: Part Reference: C20; Value: 10uF25V; PCB Footprint: ECD_5PAI
C21 = CAPACITOR POL_0: Part Reference: C21; Value: 10uF25V; PCB Footprint: ECD_5PAI
C22 = CAP NP_Dup1: Part Reference: C22; Value: 104; PCB Footprint: C_2012
C23 = CAP NP_Dup1: Part Reference: C23; Value: 104; PCB Footprint: C_2012
C24 = CAP NP: Part Reference: C24; Value: 3.9pF; PCB Footprint: C_2012
C25 = CAP NP: Part Reference: C25; Value: 3.9pF; PCB Footprint: C_2012
C26 = CAP NP_Dup1: Part Reference: C26; Value: 104; PCB Footprint: C_2012
C27 = CAP NP_Dup1: Part Reference: C27; Value: 104; PCB Footprint: C_2012
C28 = CAPACITOR POL: Part Reference: C28; Value: 2.2uF 25V; PCB Footprint: ECD_5PAI
C29 = CAPACITOR POL: Part Reference: C29; Value: 2.2uF 25V; PCB Footprint: ECD_5PAI
C30 = CAP NP_Dup1: Part Reference: C30; Value: 0.22uF; PCB Footprint: C_2012
C31 = CAPACITOR POL_0: Part Reference: C31; Value: 100uF25V; PCB Footprint: ECD_5PAI
C32 = CAPACITOR POL_0: Part Reference: C32; Value: 100uF25V; PCB Footprint: ECD_5PAI
C33 = CAP NP_Dup1: Part Reference: C33; Value: 0.15uF; PCB Footprint: C_2012
C34 = CAP NP_Dup1: Part Reference: C34; Value: 104; PCB Footprint: C_2012
C35 = CAPACITOR POL_0: Part Reference: C35; Value: 100uF25V; PCB Footprint: ECD_5PAI
C36 = CAPACITOR POL_0: Part Reference: C36; Value: 100uF25V; PCB Footprint: ECD_5PAI
C37 = CAP NP_Dup1: Part Reference: C37; Value: 0.15uF; PCB Footprint: C_2012
C38 = CAP NP_Dup1: Part Reference: C38; Value: 104; PCB Footprint: C_2012
C39 = CAPACITOR POL_0: Part Reference: C39; Value: 100uF25V; PCB Footprint: ECD_5PAI
C40 = CAP NP_Dup1: Part Reference: C40; Value: 104; PCB Footprint: C_2012
C41 = CAP NP_Dup1: Part Reference: C41; Value: 104; PCB Footprint: C_2012
C42 = CAP NP_Dup1: Part Reference: C42; Value: 104; PCB Footprint: C_2012
C43 = CAP NP_Dup1: Part Reference: C43; Value: 104; PCB Footprint: C_2012
C44 = CAP NP_Dup1: Part Reference: C44; Value: 104; PCB Footprint: C_2012
C45 = CAP NP_Dup1: Part Reference: C45; Value: 104; PCB Footprint: C_2012
C46 = CAP NP_Dup1: Part Reference: C46; Value: 104; PCB Footprint: C_2012
C47 = CAP NP_Dup1: Part Reference: C47; Value: 104; PCB Footprint: C_2012
C48 = CAP NP_Dup1: Part Reference: C48; Value: 104; PCB Footprint: C_2012
C49 = CAP NP_Dup1: Part Reference: C49; Value: 104; PCB Footprint: C_2012
C50 = CAP NP_Dup1: Part Reference: C50; Value: 104; PCB Footprint: C_2012
C51 = CAP NP_Dup1: Part Reference: C51; Value: 104; PCB Footprint: C_2012
C52 = CAP NP_Dup1: Part Reference: C52; Value: 104; PCB Footprint: C_2012
C53 = CAP NP_Dup1: Part Reference: C53; Value: 104; PCB Footprint: C_2012
C54 = CAP NP_Dup1: Part Reference: C54; Value: 104; PCB Footprint: C_2012
C55 = CAP NP_Dup1: Part Reference: C55; Value: 104; PCB Footprint: C_2012
C56 = CAPACITOR POL_0: Part Reference: C56; Value: 10uF25V; PCB Footprint: ECD_5PAI
C57 = CAP NP_Dup1: Part Reference: C57; Value: 104; PCB Footprint: C_2012
C58 = CAP NP_Dup1: Part Reference: C58; Value: 104; PCB Footprint: C_2012
C59 = CAP NP_Dup1: Part Reference: C59; Value: 104; PCB Footprint: C_2012
C60 = CAP NP_Dup1: Part Reference: C60; Value: 104; PCB Footprint: C_2012
C61 = CAP NP_Dup1: Part Reference: C61; Value: 104; PCB Footprint: C_2012
C62 = CAP NP_Dup1: Part Reference: C62; Value: 104; PCB Footprint: C_2012
C63 = CAP NP_Dup1: Part Reference: C63; Value: 104; PCB Footprint: C_2012
C64 = CAP NP_Dup1: Part Reference: C64; Value: 104; PCB Footprint: C_2012
C65 = CAP NP_Dup1: Part Reference: C65; Value: 104; PCB Footprint: C_2012
C66 = CAP NP_Dup1: Part Reference: C66; Value: 104; PCB Footprint: C_2012
C67 = CAP NP_Dup1: Part Reference: C67; Value: 104; PCB Footprint: C_2012
C68 = CAP NP_Dup1: Part Reference: C68; Value: 104; PCB Footprint: C_2012
C69 = CAP NP_Dup1: Part Reference: C69; Value: 104; PCB Footprint: C_2012
D1 = ZM4741A/CYL: Part Reference: D1; Value: DL962A; PCB Footprint: DIODE_DIP
D2#1 D2#2 = FLLD261/SOT_1: Part Reference: D2; Value: DAN217U2; PCB Footprint: SOT23
D3 = ZM4741A/CYL: Part Reference: D3; Value: DL961A; PCB Footprint: DIODE_DIP
D4 = ZM4741A/CYL: Part Reference: D4; Value: SB07-03C; PCB Footprint: SB07-03C_SOT23
D6 = ZM4741A/CYL: Part Reference: D6; Value: DL756; PCB Footprint: DIODE_DIP
D7 = ZM4741A/CYL: Part Reference: D7; Value: SB07-03C; PCB Footprint: SB07-03C_SOT23
D8 = ZM4741A/CYL: Part Reference: D8; Value: SB07-03C; PCB Footprint: SB07-03C_SOT23
J1 = CON6: Part Reference: J1; Value: CON6; PCB Footprint: SMW250-06
J2 = CON2: Part Reference: J2; Value: USART6; PCB Footprint: SMW250-02
J3 = CON12_0: Part Reference: J3; Value: 연호 2.54; PCB Footprint: SMW250-11
J4 = CON2: Part Reference: J4; Value: 5MM 연호; PCB Footprint: YW500-02
J5 = CON50: Part Reference: J5; Value: 05004HR-H50ED; PCB Footprint: 05004HR-H50ED-1
J6 = CON2: Part Reference: J6; Value: 연호 2.54_2P; PCB Footprint: SMW250-02
J7 = CON8: Part Reference: J7; Value: 05002HR-H08J05; PCB Footprint: 05002HR-H08J05
JF1#1 JF1#2 = CONN FLEX 30: Part Reference: JF1; Value: CONN FLEX 30; PCB Footprint: CONN_2.54
JF2#1 JF2#2 = CONN FLEX 30: Part Reference: JF2; Value: CONN FLEX 30; PCB Footprint: CONN_2.54
JR1 = CONN MOD 4-4_J_0: Part Reference: JR1; Value: CONN MOD 4-4_J; PCB Footprint: CONN_MOD44
JR2 = CONN MOD 4-4_J_0: Part Reference: JR2; Value: CONN MOD 4-4_J; PCB Footprint: CONN_MOD44
JR3 = CONN MOD 4-4_J_0: Part Reference: JR3; Value: CONN MOD 4-4_J; PCB Footprint: CONN_MOD44
L1 = TRANSFORMER AUTO_5: Part Reference: L1; Value: 101; PCB Footprint: LPF5017T-100M
L2 = TRANSFORMER AUTO_5: Part Reference: L2; Value: 101; PCB Footprint: LPF5017T-100M
L3 = TRANSFORMER AUTO_1: Part Reference: L3; Value: TRANSFORMER AUTO; PCB Footprint: L_2012
L4 = TRANSFORMER AUTO_5: Part Reference: L4; Value: 101; PCB Footprint: LPF5017T-100M
LS1 = BUZZER: Part Reference: LS1; Value: BUZZER
Q1 = NPN BCE_0: Part Reference: Q1; Value: KSC1623
R1 = RESISTOR VAR_0: Part Reference: R1; Value: PRESSURE_SENSOR; PCB Footprint: PRESSURE_SENSOR
R2 = R_Dup1: Part Reference: R2; Value: 1.5K; PCB Footprint: R_2012
R3 = R: Part Reference: R3; Value: 47; PCB Footprint: R_2012
R4 = R_Dup1: Part Reference: R4; Value: 100K; PCB Footprint: R_2012
R5 = R_Dup1: Part Reference: R5; Value: 33; PCB Footprint: R_2012
R6 = R_Dup1: Part Reference: R6; Value: 33; PCB Footprint: R_2012
R7 = R_Dup1: Part Reference: R7; Value: 33; PCB Footprint: R_2012
R8 = R_Dup1: Part Reference: R8; Value: 33; PCB Footprint: R_2012
R9 = R_Dup1: Part Reference: R9; Value: 33; PCB Footprint: R_2012
R10 = R_Dup1: Part Reference: R10; Value: 33; PCB Footprint: R_2012
R11 = R_Dup1: Part Reference: R11; Value: 33; PCB Footprint: R_2012
R12 = R_Dup1: Part Reference: R12; Value: 33; PCB Footprint: R_2012
R13 = R_Dup1: Part Reference: R13; Value: 33; PCB Footprint: R_2012
R14 = R_Dup1: Part Reference: R14; Value: 33; PCB Footprint: R_2012
R15 = R_Dup1: Part Reference: R15; Value: 33; PCB Footprint: R_2012
R16 = R_Dup1: Part Reference: R16; Value: 10K; PCB Footprint: R_2012
R17 = R_Dup1: Part Reference: R17; Value: 33; PCB Footprint: R_2012
R18 = R_Dup1: Part Reference: R18; Value: 33; PCB Footprint: R_2012
R19 = R_Dup1: Part Reference: R19; Value: 17.4K; PCB Footprint: R_2012
R20 = R_Dup1: Part Reference: R20; Value: 110K; PCB Footprint: R_2012
R21 = R_Dup1: Part Reference: R21; Value: 33; PCB Footprint: R_2012
R22 = R_Dup1: Part Reference: R22; Value: 33; PCB Footprint: R_2012
R23 = R_Dup1: Part Reference: R23; Value: 33; PCB Footprint: R_2012
R24 = R_Dup1: Part Reference: R24; Value: 33; PCB Footprint: R_2012
R25 = R_Dup1: Part Reference: R25; Value: 33; PCB Footprint: R_2012
R26 = R_Dup1: Part Reference: R26; Value: 33K; PCB Footprint: R_2012
R27 = R_Dup1: Part Reference: R27; Value: 33; PCB Footprint: R_2012
R28 = R_Dup1: Part Reference: R28; Value: 110K; PCB Footprint: R_2012
R29 = R_Dup1: Part Reference: R29; Value: 33; PCB Footprint: R_2012
R30 = R_Dup1: Part Reference: R30; Value: 33; PCB Footprint: R_2012
R31 = R_Dup1: Part Reference: R31; Value: 33; PCB Footprint: R_2012
R32 = R_Dup1: Part Reference: R32; Value: 12K; PCB Footprint: R_2012
R33 = R_Dup1: Part Reference: R33; Value: 15K; PCB Footprint: R_2012
R34 = R: Part Reference: R34; Value: 0; PCB Footprint: R_2012
R35 = R_Dup1: Part Reference: R35; Value: 33; PCB Footprint: R_2012
R36 = R_Dup1: Part Reference: R36; Value: 33; PCB Footprint: R_2012
R37 = R_Dup1: Part Reference: R37; Value: 33; PCB Footprint: R_2012
R38 = R_Dup1: Part Reference: R38; Value: 33; PCB Footprint: R_2012
R39 = R_Dup1: Part Reference: R39; Value: 33; PCB Footprint: R_2012
R40 = R_Dup1: Part Reference: R40; Value: 33; PCB Footprint: R_2012
R41 = R_Dup1: Part Reference: R41; Value: 33; PCB Footprint: R_2012
R42 = R_Dup1: Part Reference: R42; Value: 33; PCB Footprint: R_2012
R43 = R_Dup1: Part Reference: R43; Value: 1K; PCB Footprint: R_2012
R44 = R_Dup1: Part Reference: R44; Value: 33; PCB Footprint: R_2012
R45 = R_Dup1: Part Reference: R45; Value: 33; PCB Footprint: R_2012
R46 = R_Dup1: Part Reference: R46; Value: 100K; PCB Footprint: R_2012
R47 = R: Part Reference: R47; Value: 10K; PCB Footprint: R_2012
R48 = R: Part Reference: R48; Value: 10K; PCB Footprint: R_2012
R49 = R: Part Reference: R49; Value: 10K; PCB Footprint: R_2012
R50 = R_Dup1: Part Reference: R50; Value: 33; PCB Footprint: R_2012
R51 = R_Dup1: Part Reference: R51; Value: 33; PCB Footprint: R_2012
R54 = R_Dup1: Part Reference: R54; Value: 33; PCB Footprint: R_2012
R55 = R_Dup1: Part Reference: R55; Value: 33; PCB Footprint: R_2012
R56 = R_Dup1: Part Reference: R56; Value: 33; PCB Footprint: R_2012
R57 = R_Dup1: Part Reference: R57; Value: 33; PCB Footprint: R_2012
R58 = R_Dup1: Part Reference: R58; Value: 33; PCB Footprint: R_2012
R59 = R_Dup1: Part Reference: R59; Value: 33; PCB Footprint: R_2012
R60 = R_Dup1: Part Reference: R60; Value: 33; PCB Footprint: R_2012
R61 = R_Dup1: Part Reference: R61; Value: 33; PCB Footprint: R_2012
R62 = R_Dup1: Part Reference: R62; Value: 33; PCB Footprint: R_2012
R63 = R_Dup1: Part Reference: R63; Value: 33; PCB Footprint: R_2012
R64 = R_Dup1: Part Reference: R64; Value: 33; PCB Footprint: R_2012
R65 = R_Dup1: Part Reference: R65; Value: 33; PCB Footprint: R_2012
R66 = R_Dup1: Part Reference: R66; Value: 33; PCB Footprint: R_2012
R67 = R_Dup1: Part Reference: R67; Value: 33; PCB Footprint: R_2012
R68 = R_Dup1: Part Reference: R68; Value: 33; PCB Footprint: R_2012
R69 = R_Dup1: Part Reference: R69; Value: 33; PCB Footprint: R_2012
R70 = R_Dup1: Part Reference: R70; Value: 33; PCB Footprint: R_2012
R71 = R_Dup1: Part Reference: R71; Value: 33; PCB Footprint: R_2012
R72 = R_Dup1: Part Reference: R72; Value: 33; PCB Footprint: R_2012
R73 = R: Part Reference: R73; Value: 1.5K; PCB Footprint: R_2012
R74 = R: Part Reference: R74; Value: 1.5K; PCB Footprint: R_2012
R75 = R_Dup1: Part Reference: R75; Value: 33; PCB Footprint: R_2012
R76 = R_Dup1: Part Reference: R76; Value: 33; PCB Footprint: R_2012
R77 = R_Dup1: Part Reference: R77; Value: 33; PCB Footprint: R_2012
R78 = R_Dup1: Part Reference: R78; Value: 33; PCB Footprint: R_2012
R79 = R_Dup1: Part Reference: R79; Value: 33; PCB Footprint: R_2012
R80 = R_Dup1: Part Reference: R80; Value: 33; PCB Footprint: R_2012
R81 = R_Dup1: Part Reference: R81; Value: 10K; PCB Footprint: R_2012
R82 = R_Dup1: Part Reference: R82; Value: 33; PCB Footprint: R_2012
R83 = R_Dup1: Part Reference: R83; Value: 33; PCB Footprint: R_2012
R84 = R_Dup1: Part Reference: R84; Value: 33; PCB Footprint: R_2012
R85 = R_Dup1: Part Reference: R85; Value: 100; PCB Footprint: R_2012
R86 = R_Dup1: Part Reference: R86; Value: 100; PCB Footprint: R_2012
R87 = R_Dup1: Part Reference: R87; Value: 100K; PCB Footprint: R_2012
R88 = R: Part Reference: R88; Value: 1.5K; PCB Footprint: R_2012
R89 = R: Part Reference: R89; Value: 1.5K; PCB Footprint: R_2012
R90 = R_Dup1: Part Reference: R90; Value: 1K; PCB Footprint: R_2012
R91 = R_Dup1: Part Reference: R91; Value: 7R 1W; PCB Footprint: R_2012
R92 = R_Dup1: Part Reference: R92; Value: 100K; PCB Footprint: R_2012
R93 = R_Dup1: Part Reference: R93; Value: 100; PCB Footprint: R_2012
R94 = R_Dup1: Part Reference: R94; Value: 100; PCB Footprint: R_2012
R95 = R_Dup1: Part Reference: R95; Value: 10K; PCB Footprint: R_2012
R96 = R_Dup1: Part Reference: R96; Value: 47K; PCB Footprint: R_2012
R97 = R_Dup1: Part Reference: R97; Value: 47K; PCB Footprint: R_2012
R98 = R_Dup1: Part Reference: R98; Value: 47K; PCB Footprint: R_2012
R99 = R_Dup1: Part Reference: R99; Value: 47K; PCB Footprint: R_2012
R100 = R_Dup1: Part Reference: R100; Value: 47K; PCB Footprint: R_2012
R101 = R_Dup1: Part Reference: R101; Value: 33; PCB Footprint: R_2012
R102 = R_Dup1: Part Reference: R102; Value: 33; PCB Footprint: R_2012
R103 = R_Dup1: Part Reference: R103; Value: 33; PCB Footprint: R_2012
R104 = R_Dup1: Part Reference: R104; Value: 33; PCB Footprint: R_2012
R105 = R_Dup1: Part Reference: R105; Value: 33; PCB Footprint: R_2012
R106 = R_Dup1: Part Reference: R106; Value: 33; PCB Footprint: R_2012
R107 = R: Part Reference: R107; Value: 10K; PCB Footprint: R_2012
R108 = R: Part Reference: R108; Value: 10K; PCB Footprint: R_2012
R109 = R: Part Reference: R109; Value: 10; PCB Footprint: R_2012
R110 = R_Dup1: Part Reference: R110; Value: 10K; PCB Footprint: R_2012
R111 = R_Dup1: Part Reference: R111; Value: 0; PCB Footprint: R_2012
R112 = RESISTOR VAR: Part Reference: R112; Value: 20K; PCB Footprint: R_2012
R113 = R_Dup1: Part Reference: R113; Value: 10K 1%; PCB Footprint: R_2012
R114 = R: Part Reference: R114; Value: 10K; PCB Footprint: VRES\WIW1036(3323)P
R115 = R: Part Reference: R115; Value: 10K; PCB Footprint: R_2012
R116 = R: Part Reference: R116; Value: 10K; PCB Footprint: R_2012
R117 = R: Part Reference: R117; Value: 1.5K; PCB Footprint: R_2012
R118 = R: Part Reference: R118; Value: 1.5K; PCB Footprint: R_2012
R119 = R_Dup1: Part Reference: R119; Value: 102K; PCB Footprint: R_2012
R120 = R_Dup1: Part Reference: R120; Value: 100K; PCB Footprint: R_2012
R121 = R_Dup1: Part Reference: R121; Value: 1K; PCB Footprint: R_2012
R122 = R_Dup1: Part Reference: R122; Value: 11.8K; PCB Footprint: R_2012
R123 = R_Dup1: Part Reference: R123; Value: 100K; PCB Footprint: R_2012
R124 = R_Dup1: Part Reference: R124; Value: 33; PCB Footprint: R_2012
R125 = R_Dup1: Part Reference: R125; Value: 33; PCB Footprint: R_2012
R130 = R_Dup1: Part Reference: R130; Value: 1K
U1 = US723C/SO_0: Part Reference: U1; Value: USB; PCB Footprint: CON4_12505WR\
U2 = M1425/PFP100_56: Part Reference: U2; Value: STM32H743BIT6; PCB Footprint: STM32H743BIT6_0.5_208
U3 = C78L05/TO92_3: Part Reference: U3; Value: MP1541DJ TSOT23-5; PCB Footprint: SOT23-5
U4 = L7885/TO220_1: Part Reference: U4; Value: 278R33 TO-220F
U5 = AM9016_1: Part Reference: U5; Value: at24c02d-sshm-t   SO; PCB Footprint: SO8_P1.27_L6
U6 = C78L05/TO92_3: Part Reference: U6; Value: MP1541DJ TSOT23-5; PCB Footprint: SOT23-5
U7 = 10192_4: Part Reference: U7; Value: PJS008-2000; PCB Footprint: 7MSDP-1
U8 = 74HC691/SO_15: Part Reference: U8; Value: IS42S32800J TSOP; PCB Footprint: IS42S32800J_0.5_86
U9 = 10192_3: Part Reference: U9; Value: TEA2025D; PCB Footprint: SO20_P1.27_L10.3
U10 = 74HC691/SO_17: Part Reference: U10; Value: MT25QL512ABB1ESF; PCB Footprint: MT25QL512ABB1ESF_SO16
U11 = C78L05/TO92_3: Part Reference: U11; Value: MP1541DJ TSOT23-5; PCB Footprint: SOT23-5
Y1 = CRYSTAL: Part Reference: Y1; Value: 25MHz; PCB Footprint: XTAL_SMD
* = TitleBlock0: Page Number: 1; Page Size: =PageSize; Page Create Date: March  8, 1995; Page Modify Date: =ModifiedDate